# Altium project LimeSDR_Mini_2v0.PrjPcb (part 4 of 4)

## Sheet 10_Misc.SchDoc: Misc
size A3; Organization: Lime Microsystems; Address1: Surrey Tech Centre; Address2: Guildford GU2 7YG; Address3: Surrey; Address4: United Kingdom; Revision: v2.0; SheetNumber: 10; SheetTotal: 10
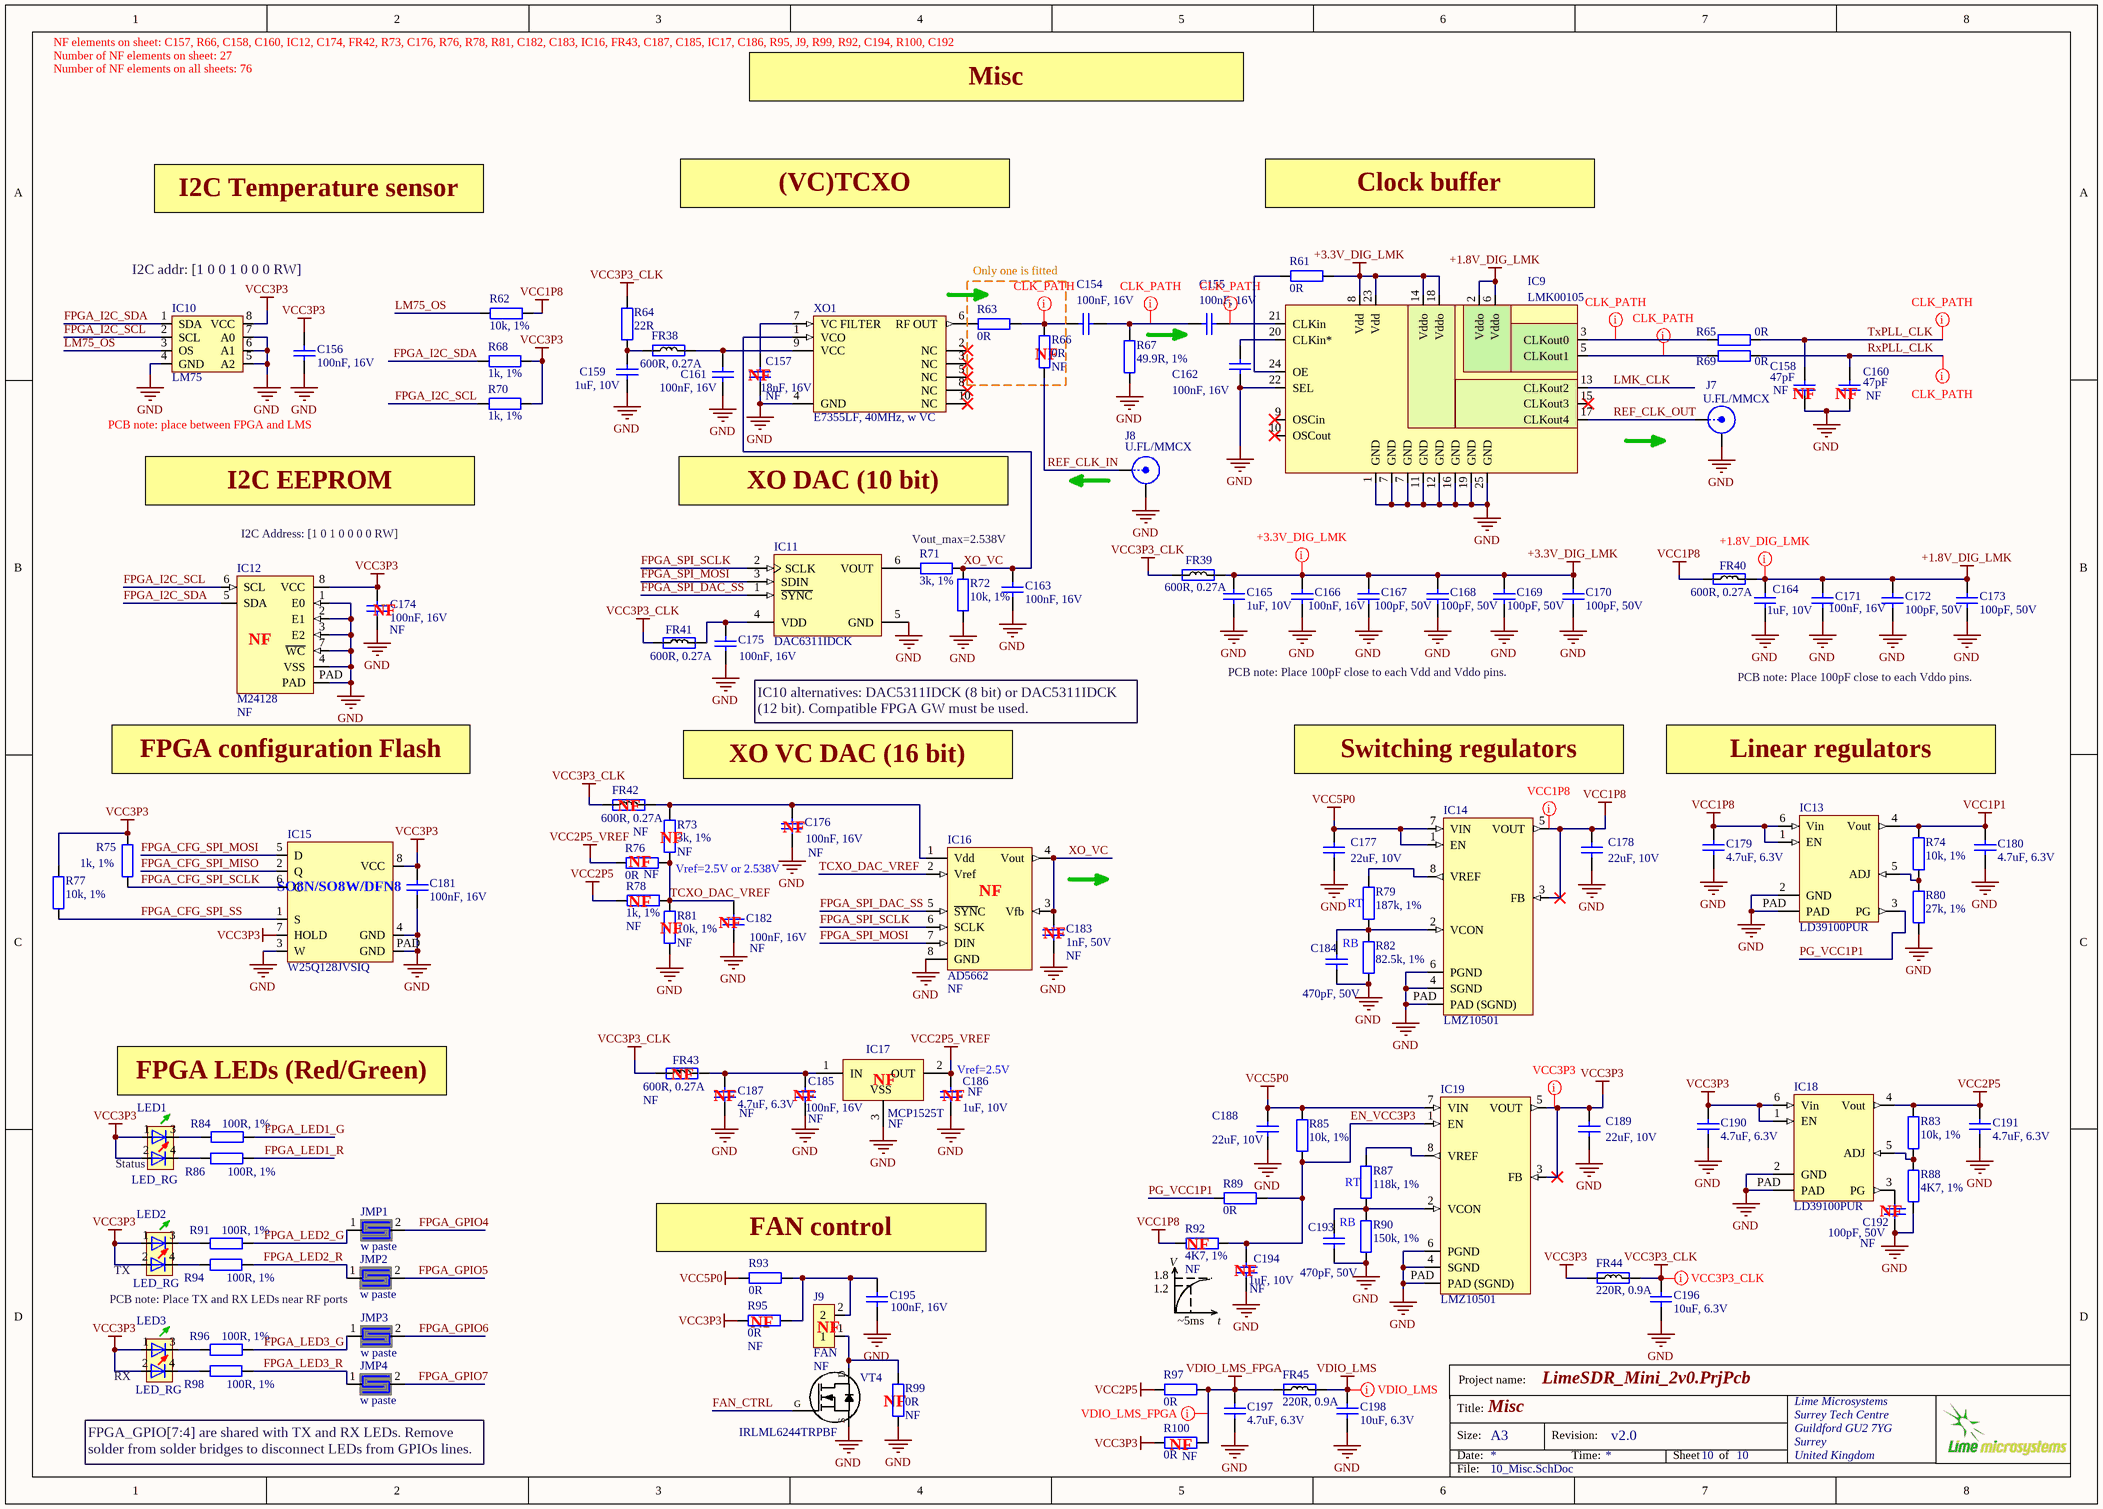
[diagram p9: 10_Misc.SchDoc]

### Parts
C154  100nF, 16V  [CAP0402]
C155  100nF, 16V  [CAP0402]
C156  100nF, 16V  [CAP0402]
C157  18nF, 16V  Assembly Info: NF  [CAP0402]
C158  47pF  Assembly Info: NF  [CAP0402]
C159  1uF, 10V  [CAP0402]
C160  47pF  Assembly Info: NF  [CAP0402]
C161  100nF, 16V  [CAP0402]
C162  100nF, 16V  [CAP0402]
C163  100nF, 16V  [CAP0402]
C164  1uF, 10V  [CAP0402]
C165  1uF, 10V  [CAP0402]
C166  100nF, 16V  [CAP0402]
C167  100pF, 50V  [CAP0402]
C168  100pF, 50V  [CAP0402]
C169  100pF, 50V  [CAP0402]
C170  100pF, 50V  [CAP0402]
C171  100nF, 16V  [CAP0402]
C172  100pF, 50V  [CAP0402]
C173  100pF, 50V  [CAP0402]
C174  100nF, 16V  Assembly Info: NF  [CAP0402]
C175  100nF, 16V  [CAP0402]
C176  100nF, 16V  Assembly Info: NF  [CAP0402]
C177  22uF, 10V  [CAP0603]
C178  22uF, 10V  [CAP0603]
C179  4.7uF, 6.3V  [CAP0402]
C180  4.7uF, 6.3V  [CAP0402]
C181  100nF, 16V  [CAP0402]
C182  100nF, 16V  Assembly Info: NF  [CAP0402]
C183  1nF, 50V  Assembly Info: NF  [CAP0402]
C184  470pF, 50V  [CAP0402]
C185  100nF, 16V  Assembly Info: NF  [CAP0402]
C186  1uF, 10V  Assembly Info: NF  [CAP0402]
C187  4.7uF, 6.3V  Assembly Info: NF  [CAP0402]
C188  22uF, 10V  [CAP0603]
C189  22uF, 10V  [CAP0603]
C190  4.7uF, 6.3V  [CAP0402]
C191  4.7uF, 6.3V  [CAP0402]
C192  100pF, 50V  Assembly Info: NF  [CAP0402]
C193  470pF, 50V  [CAP0402]
C194  1uF, 10V  Assembly Info: NF  [CAP0402]
C195  100nF, 16V  [CAP0402]
C196  10uF, 6.3V  [CAP0603]
C197  4.7uF, 6.3V  [CAP0402]
C198  10uF, 6.3V  [CAP0603]
FR38  600R, 0.27A  [RES0201]
FR39  600R, 0.27A  [RES0201]
FR40  600R, 0.27A  [RES0201]
FR41  600R, 0.27A  [RES0201]
FR42  600R, 0.27A  Assembly Info: NF  [RES0201]
FR43  600R, 0.27A  Assembly Info: NF  [RES0201]
FR44  220R, 0.9A  [RES0402]
FR45  220R, 0.9A  [RES0402]
IC9  LMK00105  [LMK00105SQ]
IC10  LM75  [HWSON8_LM75]
IC11  DAC6311IDCK  [AD5601_SOT23-6]
IC12  M24128  Assembly Info: NF  [M24128-DFMC6TG]
IC13  LD39100PUR  [LD39100PUR]
IC14  LMZ10501  [LMZ10501]
IC15  W25Q128JVSIQ  [S25FL164K_WSON8_DFN6]
IC16  AD5662  Assembly Info: NF  [AD5662_SOT23-8]
IC17  MCP1525T  Assembly Info: NF  [SOT23-3_v2]
IC18  LD39100PUR  [LD39100PUR]
IC19  LMZ10501  [LMZ10501]
J7  U.FL/MMCX  [MMCX_UFL_conn_u]
J8  U.FL/MMCX  [MMCX_UFL_conn_u]
J9  FAN  Assembly Info: NF  [Header2x1_TH_v2]
JMP1  w paste  [JUMPER_0P15_W_PASTE]  (no BOM)
JMP2  w paste  [JUMPER_0P15_W_PASTE]  (no BOM)
JMP3  w paste  [JUMPER_0P15_W_PASTE]  (no BOM)
JMP4  w paste  [JUMPER_0P15_W_PASTE]  (no BOM)
LED1  LED_RG  [LED-2x0603]
LED2  LED_RG  [LED-2x0603]
LED3  LED_RG  [LED-2x0603]
R61  0R  [RES0402]
R62  10k, 1%  [RES0402]
R63  0R  [RES0402]
R64  22R  [RES0402]
R65  0R  [RES0402]
R66  0R  Assembly Info: NF  [RES0402]
R67  49.9R, 1%  [RES0402]
R68  1k, 1%  [RES0402]
R69  0R  [RES0402]
R70  1k, 1%  [RES0402]
R71  3k, 1%  [RES0402]
R72  10k, 1%  [RES0402]
R73  3k, 1%  Assembly Info: NF  [RES0402]
R74  10k, 1%  [RES0402]
R75  1k, 1%  [RES0402]
R76  0R  Assembly Info: NF  [RES0402]
R77  10k, 1%  [RES0402]
R78  1k, 1%  Assembly Info: NF  [RES0402]
R79  187k, 1%  [RES0402]
R80  27k, 1%  [RES0402]
R81  10k, 1%  Assembly Info: NF  [RES0402]
R82  82.5k, 1%  [RES0402]
R83  10k, 1%  [RES0402]
R84  100R, 1%  [RES0402]
R85  10k, 1%  [RES0402]
R86  100R, 1%  [RES0402]
R87  118k, 1%  [RES0402]
R88  4K7, 1%  [RES0402]
R89  0R  [RES0402]
R90  150k, 1%  [RES0402]
R91  100R, 1%  [RES0402]
R92  4K7, 1%  Assembly Info: NF  [RES0402]
R93  0R  [RES0402]
R94  100R, 1%  [RES0402]
R95  0R  Assembly Info: NF  [RES0402]
R96  100R, 1%  [RES0402]
R97  0R  [RES0402]
R98  100R, 1%  [RES0402]
R99  0R  Assembly Info: NF  [RES0402]
R100  0R  Assembly Info: NF  [RES0402]
VT4  IRLML6244TRPBF  [SOT23-3]
XO1  E7355LF, 40MHz, w VC  [RAKON_RTX5032A]

### Blocks framed on the sheet
Only one is fitted: R63 R66

### Nets
+1.8V_DIG_LMK: C164.2 C171.2 C172.2 C173.2 FR40.2 IC9.2(Vddo) IC9.6(Vddo)
+3.3V_DIG_LMK: C165.2 C166.2 C167.2 C168.2 C169.2 C170.2 FR39.2 IC9.8(Vdd) IC9.14(Vddo) IC9.18(Vddo) IC9.23(Vdd) R61.2
GND: C156.2 C157.1 C158.1 C159.1 C160.1 C161.1 C162.1 C163.1 C164.1 C165.1 C166.1 C167.1 C168.1 C169.1 C170.1 C171.1 C172.1 C173.1 C174.2 C175.2 C176.2 C177.1 C178.1 C179.1 C180.1 C181.2 C182.2 C183.2 C184.2 C185.2 C186.1 C187.1 C188.1 C189.1 C190.1 C191.1 C192.1 C193.2 C194.1 C195.2 C196.1 C197.1 C198.1 IC9.1(GND) IC9.7(GND) IC9.11(GND) IC9.12(GND) IC9.16(GND) IC9.19(GND) IC9.22(SEL) IC9.25(GND) IC10.4(GND) IC10.5(A2) IC10.6(A1) IC10.7(A0) IC11.5(GND) IC12.1(E0) IC12.2(E1) IC12.3(E2) IC12.4(VSS) IC12.7(~{WC}) IC12.PAD IC13.2(GND) IC13.PAD IC14.4(SGND) IC14.6(PGND) IC14.PAD(PAD_(SGND)) IC15.3(W) IC15.4(GND) IC15.PAD(GND) IC16.8(GND) IC17.3(VSS) IC18.2(GND) IC18.PAD IC19.4(SGND) IC19.6(PGND) IC19.PAD(PAD_(SGND)) J7.2(Y) J8.2(Y) R67.1 R72.2 R80.2 R81.2 R82.1 R88.2 R90.1 R99.1 VT4.S XO1.4(GND)
VCC1P1: C180.2 IC13.4(Vout) R74.2
VCC1P8: C178.2 C179.2 FR40.1 IC13.1(EN) IC13.6(Vin) IC14.3(FB) IC14.5(VOUT) R62.2 R92.2
VCC2P5: C191.2 IC18.4(Vout) R78.2 R83.2 R97.1
VCC2P5_VREF: C186.2 IC17.2(OUT) R76.1
VCC3P3: C156.1 C174.1 C181.1 C189.2 C190.2 FR44.1 IC10.8(VCC) IC12.8(VCC) IC15.7(HOLD) IC15.8(VCC) IC18.1(EN) IC18.6(Vin) IC19.3(FB) IC19.5(VOUT) LED1.1 LED1.2 LED2.1 LED2.2 LED3.1 LED3.2 R68.1 R70.1 R75.2 R77.2 R95.1 R100.1
VCC3P3_CLK: C196.2 FR39.1 FR41.1 FR42.1 FR43.1 FR44.2 R64.2
VCC5P0: C177.2 C188.2 IC14.1(EN) IC14.7(VIN) IC19.7(VIN) R85.2 R93.1
VDIO_LMS: C198.2 FR45.2
VDIO_LMS_FPGA: C197.2 FR45.1 R97.2 R100.2
EN_VCC3P3: C194.2 IC19.1(EN) R85.1 R89.2 R92.1
FAN_CTRL: VT4.G
FPGA_CFG_SPI_MISO: IC15.2(Q)
FPGA_CFG_SPI_MOSI: IC15.5(D)
FPGA_CFG_SPI_SCLK: IC15.6(C) R75.1
FPGA_CFG_SPI_SS: IC15.1(S) R77.1
FPGA_GPIO4: JMP1.2
FPGA_GPIO5: JMP2.2
FPGA_GPIO6: JMP3.2
FPGA_GPIO7: JMP4.2
FPGA_I2C_SCL: IC10.2(SCL) IC12.6(SCL) R70.2
FPGA_I2C_SDA: IC10.1(SDA) IC12.5(SDA) R68.2
FPGA_LED1_G: R84.2
FPGA_LED1_R: R86.2
FPGA_LED2_G: JMP1.1 R91.2
FPGA_LED2_R: JMP2.1 R94.2
FPGA_LED3_G: JMP3.1 R96.2
FPGA_LED3_R: JMP4.1 R98.2
FPGA_SPI_DAC_SS: IC11.1(~{SYNC}) IC16.5(~{SYN}C)
FPGA_SPI_MOSI: IC11.3(SDIN) IC16.7(DIN)
FPGA_SPI_SCLK: IC11.2(SCLK) IC16.6(SCLK)
LM75_OS: IC10.3(OS) R62.1
LMK_CLK: IC9.13(CLKout2)
PG_VCC1P1: IC13.3(PG) R89.1
REF_CLK_IN: J8.1(X) R66.1
REF_CLK_OUT: IC9.17(CLKout4) J7.1(X)
RxPLL_CLK: C160.2 R69.1
TCXO_DAC_VREF: C182.1 IC16.2(Vref) R73.1 R76.2 R78.1 R81.1
TxPLL_CLK: C158.2 R65.1
XO_VC: C163.2 C183.1 IC16.3(Vfb) IC16.4(Vout) R71.1 R72.1 XO1.1(VCO)
NetC154_1: C154.1 C155.2 R67.2
NetC154_2: C154.2 R63.2 R66.2
NetC155_1: C155.1 IC9.21(CLKin)
NetC157_2: C157.2 XO1.7(VC_FILTER)
NetC159_2: C159.2 FR38.1 R64.1
NetC161_2: C161.2 FR38.2 XO1.9(VCC)
NetC162_2: C162.2 IC9.20(CLKin*)
NetC175_1: C175.1 FR41.2 IC11.4(VDD)
NetC176_1: C176.1 FR42.2 IC16.1(Vdd) R73.2
NetC184_1: C184.1 IC14.2(VCON) R79.1 R82.2
NetC185_1: C185.1 C187.2 FR43.2 IC17.1(IN)
NetC192_2: C192.2 IC18.3(PG)
NetC193_1: C193.1 IC19.2(VCON) R87.1 R90.2
NetC195_1: C195.1 J9.2 R93.2 R95.2
NetIC9_3: IC9.3(CLKout0) R65.2
NetIC9_5: IC9.5(CLKout1) R69.2
NetIC9_24: IC9.24(OE) R61.1
NetIC11_6: IC11.6(VOUT) R71.2
NetIC13_5: IC13.5(ADJ) R74.1 R80.1
NetIC14_8: IC14.8(VREF) R79.2
NetIC18_5: IC18.5(ADJ) R83.1 R88.1
NetIC19_8: IC19.8(VREF) R87.2
NetJ9_1: J9.1 R99.2 VT4.D
NetLED1_3: LED1.3 R84.1
NetLED1_4: LED1.4 R86.1
NetLED2_3: LED2.3 R91.1
NetLED2_4: LED2.4 R94.1
NetLED3_3: LED3.3 R96.1
NetLED3_4: LED3.4 R98.1
NetR63_1: R63.1 XO1.6(RF_OUT)

Not connected (* = marked no-connect by the designer): IC9 9(OSCin)* 10(OSCout)* 15(CLKout3)*; XO1 2(NC)* 3(NC)* 5(NC)* 8(NC)* 10(NC)*

### Layout directives
net class CLK_PATH: NetC154_1, NetC154_2, NetC155_1, NetIC9_3, NetIC9_5, RxPLL_CLK, TxPLL_CLK
net class VCC3P3: VCC3P3
net class +3.3V_DIG_LMK: +3.3V_DIG_LMK
net class +1.8V_DIG_LMK: +1.8V_DIG_LMK
net class VCC3P3_CLK: VCC3P3_CLK
net class VCC1P8: VCC1P8
net class VDIO_LMS: VDIO_LMS
net class VDIO_LMS_FPGA: VDIO_LMS_FPGA

### Notes on the sheet
- NF elements on sheet: C157, R66, C158, C160, IC12, C174, FR42, R73, C176, R76, R78, R81, C182, C183, IC16, FR43, C187, C185, IC17, C186, R95, J9, R99, R92, C194, R100, C192
- Number of NF elements on sheet: 27
- Number of NF elements on all sheets: 76
- Misc
- I2C Temperature sensor
- (VC)TCXO
- Clock buffer
- I2C addr: [1 0 0 1 0 0 0 RW]
- (near C157) NF
- (near R66) NF
- PCB note: place between FPGA and LMS
- (near C158) NF
- (near C160) NF
- I2C EEPROM
- XO DAC (10 bit)
- I2C Address: [1 0 1 0 0 0 0 RW]
- Vout_max=2.538V
- (near IC12) NF
- (near C174) NF
- IC10 alternatives: DAC5311IDCK (8 bit) or DAC5311IDCK (12 bit). Compatible FPGA GW must be used.
- PCB note: Place 100pF close to each Vdd and Vddo pins.
- PCB note: Place 100pF close to each Vddo pins.
- (near IC12) FPGA configuration Flash
- XO VC DAC (16 bit)
- Switching regulators
- Linear regulators
- (near FR42) NF
- (near R73) NF
- (near C176) NF
- (near R78) NF
- (near R76) NF
- Vref=2.5V or 2.538V
- (near IC16) NF
- (near R79) RT
- (near R81) NF
- (near C182) NF
- NF
- (near C184) RB
- FPGA LEDs (Red/Green)
- (near FR43) NF
- (near C187) NF
- (near C185) NF
- (near IC17) NF
- (near C186) NF
- (near C186) Vref=2.5V
- (near LED1) Status
- (near R87) RT
- FAN control
- (near R92) NF
- (near C193) RB
- (near JMP2) PCB note: Place TX and RX LEDs near RF ports
- (near LED2) TX
- (near R95) NF
- (near R92) 1.8
- (near R92) 1.2
- (near R92) V
- ~5ms
- t
- (near C194) NF
- (near LED3) RX
- (near J9) NF
- FPGA_GPIO[7:4] are shared with TX and RX LEDs. Remove solder from solder bridges to disconnect LEDs from GPIOs lines.
- (near R99) NF
- (near R100) NF
- Project name:
- Title:
- Size:
- Date:
- A3
- Revision:
- Time:
- Sheet
- of
- File:
- (in symbol M25P40_with_pad) SO8N/SO8W/DFN8

### Library data of the parts
C154 C155 C161-C163 C166 C171 = Cap_0402: as C97 on sheet 08_FPGA; Value: 100nF, 16V; Supplier 1: Mouser; Supplier Part Number 1: 81-GRM155R71C104KA88; Case Code - in: 0402; RoHS: RoHS Compliant; Operating Temperature Range: - 55 C to + 125 C; Series: GRM; Termination Style: SMD/SMT; Package / Case: 0402 (1005 metric); Voltage Rating DC: 16 V; Maximum Operating Temperature: + 125 C; Case Code - mm: 1005; Minimum Operating Temperature: - 55 C; Product Category: Low & Medium Capacitance SMD Ceramic Chip Capacitors; Packaging: Reel; Product: General Type MLCCs; Category: Multilayer Ceramic Capacitors MLCC - SMD/SMT; Brand: Murata Electronics; Case Width: 0.5 mm; RoHS - Mouser: Y; Standard Pack Qty: 10000; Minimum Order Quantity: 1; Reeling: True; Manufacturer Part Number 1: GRM155R71C104KA88D
C156 C174-C176 C181 C182 C185 C195 = Cap_0603: as C129 on sheet 09_USB3_0_FIFO; Supplier 1: Mouser; Supplier Part Number 1: 81-GRM155R71C104KA88; Case Code - in: 0402; Manufacturer: Murata Electronics; Category: Multilayer Ceramic Capacitors MLCC - SMD/SMT; Voltage Rating DC: 16 V; Value: 100nF, 16V; Case Code - mm: 1005; Case Width: 0.5 mm; Maximum Operating Temperature: + 125 C; Minimum Operating Temperature: - 55 C; Minimum Order Quantity: 1; Operating Temperature Range: - 55 C to + 125 C; Package / Case: 0402 (1005 metric); Packaging: Reel; Product: General Type MLCCs; Product Category: Low & Medium Capacitance SMD Ceramic Chip Capacitors; Reeling: True; RoHS - Mouser: Y; RoHS: RoHS Compliant; Series: GRM; Standard Pack Qty: 10000; Termination Style: SMD/SMT
  C156 C174-C176 C181 C195: Manufacturer Part Number: GRM155R71C104KA88D
C157 = Cap_0402: Manufacturer: Yageo; Manufacturer Part Number 1: CC0402KRX7R7BB183; Part Description: CAP CER 0.018UF 16V X7R 0402; Temperature Coefficient: X7R; Capacitance: 0.018µF; Tolerance: ±10%; Value: 18nF, 16V; Supplier 1: Digi-Key; Supplier Part Number 1: 311-1706-1-ND; Part Status: Active; Category: Capacitors; Packaging: Cut Tape (CT); Voltage - Rated: 16V; RoHS: RoHS Compliant; Size / Dimension: 0.039" L x 0.020" W (1.00mm x 0.50mm); Package / Case: 0402 (1005 Metric); Mounting Type: Surface Mount, MLCC; Thickness (Max): 0.022" (0.55mm); Applications: General Purpose; Operating Temperature: -55°C ~ 125°C
C158 C160 = Cap_0402: Manufacturer Part Number 1: GRM1555C1H470FA01D; Manufacturer: TDK Corporation; Part Description: 47pF ±1% 50V C0G, NP0 Ceramic Capacitor -55°C ~ 125°C Surface Mount, MLCC 0402 (1005 Metric) 0.039" L x 0.020" W (1.00mm x 0.50mm); Voltage - Rated: 50V; Temperature Coefficient: C0G, NP0; Tolerance: ±1%; Value: 47pF; Supplier 1: Digi-Key; Supplier Part Number 1: 490-6241-1-ND; Package / Case: 0402 (1005 Metric); Lead Spacing: -; Ratings: -; Mounting Type: Surface Mount, MLCC; Operating Temperature: -55°C ~ 125°C; Thickness (Max): 0.022" (0.55mm); Capacitance: 47pF; Packaging: Cut Tape (CT); Features: -; Applications: General Purpose; Lead Style: -; Size / Dimension: 0.039" L x 0.020" W (1.00mm x 0.50mm); Height - Seated (Max): -; RoHS: RoHS Compliant; Category: Capacitors
C159 C164 C165 C186 C194 = Cap_0402: Manufacturer Part Number 1: C1005X5R1E105K050BC; Manufacturer: TDK; Part Description: 1µF ±10% 10V X5R Ceramic Capacitor -55°C ~ 85°C Surface Mount, MLCC 0402 (1005 Metric) 0.039" L x 0.020" W (1.00mm x 0.50mm); Voltage Rating: 10; Capacitance Tolerance: ± 10%; Product Range: TDK - C Series; Ceramic Capacitor Case: 0402 [1005 Metric]; Capacitance: 1; Dielectric Characteristic: X6; Value: 1uF, 10V; Supplier 1: Digi-Key; Supplier Part Number 1: 445-9066-1-ND; MSL: -; RoHS: YES
C167-C170 C172 C173 C192 = Cap_0402: Manufacturer Part Number 1: CC0402JRNPO9BN101; Manufacturer: Yageo; Part Description: 100pF ±5% 50V C0G, NP0 Ceramic Capacitor -55°C ~ 125°C Surface Mount, MLCC 0402 (1005 Metric) 0.039" L x 0.020" W (1.00mm x 0.50mm); Temperature Coefficient: C0G, NP0; Tolerance: ±5%; Value: 100pF, 50V; Supplier 1: Digi-Key; Supplier Part Number 1: 311-1024-1-ND; RoHS: RoHS Compliant; Category: Capacitors; Applications: General Purpose; Mounting Type: Surface Mount, MLCC; Capacitance: 100pF; Ratings: -; Packaging: Cut Tape (CT); Voltage - Rated: 50V; Size / Dimension: 0.039" L x 0.020" W (1.00mm x 0.50mm); Height - Seated (Max): -; Package / Case: 0402 (1005 Metric); Operating Temperature: -55°C ~ 125°C; Features: -; Lead Spacing: -; Lead Style: -; Thickness (Max): 0.022" (0.55mm)
C177 C178 C188 C189 = Cap_0603: Manufacturer Part Number 1: C1608X5R1A226M080AC; Manufacturer: TDK Corporation; Part Description: 22µF ±20% 10V X5R Ceramic Capacitor -55°C ~ 85°C Surface Mount, MLCC 0603 (1608 Metric) 0.063" L x 0.031" W (1.60mm x 0.80mm); Brand: TDK; Temperature Coefficient / Code: +/- 15 %; Tolerance: 20 %; Type: Multilayer Ceramic Chip Capacitor; Supplier 1: Mouser; Supplier Part Number 1: 810-C1608X5R1A226M; Package / Case: 0603 (1608 metric); Category: Multilayer Ceramic Capacitors MLCC - SMD/SMT; Capacitance: 22 uF; Operating Temperature Range: - 55 C to + 85 C; Case Code - in: 0603; Voltage Rating DC: 10 V; Case Code - mm: 1608; Value: 22uF, 10V
C179 C180 C187 C190 C191 C197 = Cap_0402: Manufacturer: Murata Electronics North America; Manufacturer Part Number 1: GRM155R60J475ME87D; Part Description: 4.7µF ±20% 6.3V X5R Ceramic Capacitor -55°C ~ 85°C Surface Mount, MLCC 0402 (1005 Metric) 0.039" L x 0.020" W (1.00mm x 0.50mm); Tolerance: ±20%; Capacitance: 4.7µF; Temperature Coefficient: X5R; Lead Style: -; Ratings: -; Height - Seated (Max): -; Thickness (Max): 0.022" (0.55mm); Voltage - Rated: 6.3V; Packaging: Cut Tape (CT); Lead Spacing: -; Category: Capacitors; Supplier Part Number 1: 490-5408-1-ND; Applications: General Purpose; Operating Temperature: -55°C ~ 85°C; Mounting Type: Surface Mount, MLCC; Features: Derating Recommended; RoHS: RoHS Compliant; Supplier 1: Digi-Key; Package / Case: 0402 (1005 Metric); Size / Dimension: 0.039" L x 0.020" W (1.00mm x 0.50mm); Value: 4.7uF, 6.3V
C183 = Cap_0402: Manufacturer Part Number 1: GCM155R71H102KA37D; Part Description: 1000pF ±10% 50V X7R Ceramic Capacitor -55°C ~ 125°C Surface Mount, MLCC 0402 (1005 Metric) 0.039" L x 0.020" W (1.00mm x 0.50mm); Capacitance: 1000 pF; Type: Automotive Ultra Small MLCC; Tolerance: 10 %; Brand: Murata Electronics; Case Height: 0.5 mm; Case Length: 1 mm; Dielectric: X7R; Temperature Coefficient / Code: +/- 15 %; Value: 1nF, 50V; Supplier 1: Mouser; Supplier Part Number 1: 81-GCM155R71H102KA7D; Case Code - in: 0402; Package / Case: 0402 (1005 metric); Termination Style: SMD/SMT; Packaging: Reel; Operating Temperature Range: - 55 C to + 125 C; Maximum Operating Temperature: + 125 C; Manufacturer: Murata Electronics; Category: Multilayer Ceramic Capacitors MLCC - SMD/SMT; RoHS: RoHS Compliant; Series: GCM; Case Width: 0.5 mm; Voltage Rating DC: 50 V; Case Code - mm: 1005; Product: Automotive MLCCs; Standard Pack Qty: 10000; Reeling: True; RoHS - Mouser: Y; Minimum Order Quantity: 1; Product Category: Automotive Ceramic Chip Capacitors; Minimum Operating Temperature: - 55 C
C184 C193 = Cap_0402: Manufacturer Part Number 1: C1005C0G1H471J050BA; Manufacturer: TDK Corporation; Part Description: 470pF ±5% 50V Ceramic Capacitor C0G, NP0 0402 (1005 Metric); Tolerance: ±5%; Temperature Coefficient: C0G, NP0; Value: 470pF, 50V; Supplier 1: Digi-Key; Supplier Part Number 1: 445-2656-6-ND; Ratings: -; Package / Case: 0402 (1005 Metric); Capacitance: 470pF; Packaging: Digi-Reel®; RoHS: RoHS Compliant; Lead Style: -; Thickness (Max): 0.022" (0.55mm); Size / Dimension: 0.039" L x 0.020" W (1.00mm x 0.50mm); Lead Spacing: -; Operating Temperature: -55°C ~ 125°C; Height - Seated (Max): -; Applications: General Purpose; Mounting Type: Surface Mount, MLCC; Voltage - Rated: 50V; Category: Capacitors; Features: -
C196 C198 = Cap_0603: as C99 on sheet 08_FPGA; Supplier 1: Digi-Key; Supplier Part Number 1: 311-1448-2-ND; Package / Case: 0603 (1608 Metric); Category: Capacitors; Voltage - Rated: 6.3V; Value: 10uF, 6.3V
FR38-FR43 = Ferrite: Manufacturer Part Number 1: BK0603TS601-T; Manufacturer: Taiyo Yuden; Part Description: FERRITE BEAD 600 OHM 0201 1LN; DC Resistance (DCR): 750 mOhm Max; Filter Type: Differential Mode - Single; Impedance @ Frequency: 600 Ohm @ 100MHz; Current Rating: 270mA; Value: 600R@100MHz; Supplier 1: Digi-Key; Supplier Part Number 1: 587-3277-1-ND; Size / Dimension: 0.024" L x 0.012" W (0.60mm x 0.30mm); Package / Case: 0201 (0603 Metric); Height (Max): 0.013" (0.33mm); Mounting Type: Surface Mount; Packaging: Cut Tape (CT); RoHS: RoHS Compliant; Category: Filters
FR44 FR45 = Ferrite: as FR35 on sheet 09_USB3_0_FIFO; Supplier 1: Digi-Key; Package / Case: 0402 (1005 Metric); Category: Filters; Supplier Part Number 1: 445-9329-2-ND; Value: 220R, 0.9A
IC9 = LMK00105: Manufacturer: Texas Instruments; Manufacturer Part Number 1: LMK00105SQ/NOPB; Part Description: IC CLK BUFFER 2:5 200MHZ 24WQFN; Frequency - Max: 200MHz; Voltage - Supply: 2.375 V ~ 3.45 V; Input: HCSL, LVCMOS, LVDS, LVPECL, LVTTL, SSTL, Crystal; Differential - Input:Output: Yes/No; Supplier 1: Digi-Key; Type: Fanout Buffer (Distribution), Multiplexer, Translator; Category: Integrated Circuits (ICs); Operating Temperature: -40°C ~ 85°C; Package / Case: 24-WFQFN Exposed Pad; Supplier Device Package: 24-WQFN (4x4); Supplier Part Number 1: LMK00105SQ/NOPBCT-ND
IC10 = LM75: Manufacturer: NXP Semiconductors; Manufacturer Part Number 1: LM75BTP,147; Part Description: SENSOR TEMPERATURE I2C 8HWSON; Sensing Temperature - Local: -55°C ~ 125°C; Output Type: I²C; Accuracy - Highest (Lowest): ±2°C (±3°C); Voltage - Supply: 2.8 V ~ 5.5 V; Test Condition: -25°C ~ 100°C (-55°C ~ 125°C); Sensor Type: Digital, Local; Resolution: 10 b; Supplier 1: Digi-Key; Operating Temperature: -55°C ~ 125°C; Features: Output Switch, Programmable Limit, Shutdown Mode; Supplier Device Package: 8-HWSON (2x3); Sensing Temperature - Remote: -; Category: Sensors, Transducers; Packaging: Tape & Reel (TR); RoHS: RoHS Compliant; Package / Case: 8-WFDFN Exposed Pad; Supplier Part Number 1: 568-9815-2-ND
IC11 = AD5601BKSZ-REEL7: Single 8-Bit nanoDAC with SPI Interface in LFCSP and SC70, 2.7 to 5.5 V, <100 uA, -40 to +125 degC, KS-6, Pb-Free, Reel; Manufacturer: Texas Instruments; Manufacturer Part Number 1: DAC6311IDCKT; Part Description: 10 Bit Digital to Analog Converter 1 SC-70-6; Max Power Dissipation: 880uW; Max Supply Voltage: 5.5V; Min Supply Voltage: 1.8V; Number of Channels: 1; Operating Supply Voltage: 5V; Settling Time: 6us; Number of Bits: 10; Resolution: 10b; Sampling Rate: 225KS/s; Polarity: Unipolar; Integral Nonlinearity (INL): 0.5LSB; Spurious-free dynamic range (SFDR): 65dB; Signal to Noise Ratio (SNR): 81dB; Nominal Supply Current: 110uA; Output Type: Voltage; ComponentLink1URL: http://www.ti.com/lit/ds/symlink/dac5311.pdf; ComponentLink1Description: http://www.ti.com/lit/ds/symlink/dac5311.pdf; Supplier 1: Digi-Key; Supplier Part Number 1: 296-23716-1-ND; Stock 1: 13410; Pricing 1: 1=2,37000, 10=2,13100, 25=2,01000, 100=1,71250 (USD); RoHS: Yes; Case/Package: SC; Number of Pins: 6; Contact Plating: Gold; Min Operating Temperature: -40°C; Max Operating Temperature: 125°C; Package Quantity: 1; Packaging: Tape and Reel; Number of DAC Channels: 1; Interface: SPI; Number of Converters: 1; Number of D/A Converters: 1; Termination: SMD/SMT; Supply Type: Single; Conversion Rate: 225KS/s; Differential Nonlinearity: 0.5LSB; Length: 2mm; Width: 1.25mm; Height: 0.9mm; Radiation Hardening: No; REACH SVHC: No SVHC; Lead Free: Lead Free; RoHS Compliant: Yes; ComponentLink2URL: https://datasheet.ciiva.com/1362/dac7311-1362880.pdf?src-supplier=Digi-Key; ComponentLink2Description: https://datasheet.ciiva.com/1362/dac7311-1362880.pdf?src-supplier=Digi-Key; ComponentLink3URL: https://datasheet.ciiva.com/4779/sbas442a-125649-4779152.pdf?src-supplier=Mouser; ComponentLink3Description: https://datasheet.ciiva.com/4779/sbas442a-125649-4779152.pdf?src-supplier=Mouser; ComponentLink4URL: https://datasheet.ciiva.com/1494/1833965-1494412.pdf?src-supplier=Element14; ComponentLink4Description: https://datasheet.ciiva.com/1494/1833965-1494412.pdf?src-supplier=Element14; ComponentLink5URL: https://datasheet.ciiva.com/1503/dac5311-1503186.pdf?src-supplier=Farnell; ComponentLink5Description: https://datasheet.ciiva.com/1503/dac5311-1503186.pdf?src-supplier=Farnell; ComponentLink6URL: https://datasheet.ciiva.com/46391/1833965-46391478.pdf?src-supplier=Element14; ComponentLink6Description: https://datasheet.ciiva.com/46391/1833965-46391478.pdf?src-supplier=Element14; ComponentLink7URL: https://datasheet.ciiva.com/1368/dac5311-1368577.pdf?src-supplier=Digi-Key; ComponentLink7Description: https://datasheet.ciiva.com/1368/dac5311-1368577.pdf?src-supplier=Digi-Key; ComponentLink8URL: https://datasheet.ciiva.com/1368/dac5311-1368578.pdf?src-supplier=Digi-Key; ComponentLink8Description: https://datasheet.ciiva.com/1368/dac5311-1368578.pdf?src-supplier=Digi-Key; ComponentLink9URL: https://datasheet.ciiva.com/15146/getdatasheetpartid-213912-15146949.pdf?src-supplier=Verical; ComponentLink9Description: https://datasheet.ciiva.com/15146/getdatasheetpartid-213912-15146949.pdf?src-supplier=Verical
IC12 = M24128-DFMC6TG: Manufacturer: STMicroelectronics; Part Description: EEPROM Memory IC 128Kb (16K x 8) I²C 1MHz 450ns 8-UFDFPN (2x3); Memory Type: Non-Volatile; Memory Format: EEPROM; Memory Size: 128Kb (16K x 8); Write Cycle Time - Word, Page: 5ms; Memory Interface: I²C; Voltage - Supply: 1.7 V ~ 5.5 V; Supplier 1: Digi-Key; Manufacturer Part Number 1: M24128-DFMC6TG; RoHS: RoHS Compliant; Category: Integrated Circuits (ICs); Stock 1: 5894; Pricing 1: 1=0.35, 10=0.348, 100=0.2854, 500=0.27748, 1000=0.27004 (USD); Packaging: Cut Tape (CT); Part Status: Active; Technology: EEPROM; Operating Temperature: -40°C ~ 85°C (TA); Mounting Type: Surface Mount; Package / Case: 8-UFDFN Exposed Pad; Supplier Device Package: 8-UFDFPN (2x3); ComponentLink1URL: http://www.st.com/content/ccc/resource/technical/document/datasheet/59/05/c9/5b/7b/41/48/b6/CD00259167.pdf/files/CD00259167.pdf/jcr:content/translations/en.CD00259167.pdf; ComponentLink1Description: http://www.st.com/content/ccc/resource/technical/document/datasheet/59/05/c9/5b/7b/41/48/b6/CD00259167.pdf/files/CD00259167.pdf/jcr:content/translations/en.CD00259167.pdf; Supplier Part Number 1: 497-15739-1-ND
IC13 IC18 = LD39100PUR: Manufacturer: STMicroelectronics; Part Description: Linear Voltage Regulator IC Positive Adjustable Output 0.8 V ~ 4.5 V 1A 6-DFN (3x3); Output Configuration: Positive; Output Type: Adjustable; Voltage - Input (Max): 5.5V; Voltage - Output (Min/Fixed): 0.8V; Voltage - Output (Max): 4.6V; Voltage Dropout (Max): 0.4V @ 1A; Current - Output: 1A; Current - Supply: 50µA ~ 300µA; PSRR: 70dB ~ 65dB (1kHz ~ 10kHz); Control Features: Enable, Power Good; Protection Features: Over Current, Over Temperature, Short Circuit; Supplier 1: Digi-Key; Manufacturer Part Number 1: LD39100PUR; RoHS: RoHS Compliant; Category: Integrated Circuits (ICs); Stock 1: 27970; Pricing 1: 1=0.85, 10=0.76, 100=0.5923, 500=0.48926, 1000=0.38625 (USD); Packaging: Cut Tape (CT); Part Status: Active; Operating Temperature: -40°C ~ 125°C; Mounting Type: Surface Mount; Package / Case: 6-VDFN Exposed Pad; Supplier Device Package: 6-DFN (3x3); ComponentLink1URL: http://www.st.com/content/ccc/resource/technical/document/datasheet/72/02/e5/ee/df/36/40/5e/CD00233788.pdf/files/CD00233788.pdf/jcr:content/translations/en.CD00233788.pdf; ComponentLink1Description: http://www.st.com/content/ccc/resource/technical/document/datasheet/72/02/e5/ee/df/36/40/5e/CD00233788.pdf/files/CD00233788.pdf/jcr:content/translations/en.CD00233788.pdf; Supplier Part Number 1: 497-11013-1-ND
IC14 IC19 = LMZ10501: Manufacturer: Texas Instruments; Manufacturer Part Number 1: LMZ10501SILR; Part Description: n  Non-Isolated PoL Module DC DC Converter 1 Output 0.6 ~ 3.6 V 1A 2.7V - 5.5V Input; Voltage - Input (Min): 2.7V; Voltage - Input (Max): 5.5V; Voltage - Output 1: 0.6 ~ 3.6 V; Current - Output (Max): 1A; Efficiency: 95%; Supplier 1: Digi-Key; RoHS: RoHS Compliant; Category: Power Supplies - Board Mount; Stock 1: 26559; Pricing 1: 1=2.46, 5=2.424, 10=2.388, 25=2.318, 50=2.2478, 100=2.1776, 250=2.1074, 500=1.96688 (USD); Packaging: Cut Tape (CT); Part Status: Active; Type: Non-Isolated PoL Module; Voltage - Output 2: -; Voltage - Output 3: -; Applications: ITE (Commercial); Features: OCP, OTP, UVLO; Operating Temperature: -40°C ~ 125°C; Mounting Type: Surface Mount; Package / Case: 8-LDFN Exposed Pad, Module; Size / Dimension: 0.12" L x 0.10" W x 0.03" H (3.0mm x 2.5mm x 0.7mm); Supplier Device Package: 8-uSIP; ComponentLink1URL: http://www.ti.com/lit/ds/symlink/lmz10501.pdf; ComponentLink1Description: http://www.ti.com/lit/ds/symlink/lmz10501.pdf; Supplier Part Number 1: 296-37104-1-ND
IC15 = M25P40_with_pad: Manufacturer: Winbond; Part Description: FLASH - NOR Memory IC 128Mb (16M x 8) SPI - Quad I/O, QPI, DTR 133 MHz 8-SOIC; Memory Type: FLASH,NOR; Frequency: 104MHz; Interface: SPI,Serial; Supplier 1: Digi-Key; Supplier Part Number 1: W25Q128JVSIQ-ND; Manufacturer Part Number 1: W25Q128JVSIQ; Stock 1: 7729; Pricing 1: 1=1,88000, 10=1,71400, 25=1,66760, 50=1,65880, 100=1,48280, 250=1,47852, 500=1,45618, 1000=1,39437, 5000=1,29820 (USD); RoHS: Yes; Case/Package: SOIC; Min Operating Temperature: -40°C; Max Operating Temperature: 85°C; Packaging: Tray; RoHS Compliant: Yes; ComponentLink1URL: http://www.winbond.com/resource-files/w25q128jv%20revf%2003272018%20plus.pdf?src-supplier=Digi-Key; ComponentLink1Description: http://www.winbond.com/resource-files/w25q128jv%20revf%2003272018%20plus.pdf?src-supplier=Digi-Key
IC16 = AD5662: Manufacturer: Analog Devices Inc.; Manufacturer Part Number 1: AD5662BRJZ-2REEL7; Part Description: IC DAC 16BIT BUFF V-OUT SOT23-8; Number of Bits: 16; Number of D/A Converters: 1; Settling Time: 10µs; Output Type: Voltage - Buffered; Differential Output: No; Data Interface: SPI, DSP; Reference Type: External; Voltage - Supply, Analog: 2.7 V ~ 5.5 V; INL/DNL (LSB): ±8, ±1 (Max); Architecture: String DAC; Supplier 1: Digi-Key; RoHS: RoHS Compliant; Category: Integrated Circuits (ICs); Stock 1: 2784; Pricing 1: 1=7.55, 10=6.821, 100=5.6469, 500=4.91722, 1000=4.28274 (USD); Packaging: Cut Tape (CT); Part Status: Active; Voltage - Supply, Digital: 2.7 V ~ 5.5 V; Operating Temperature: -40°C ~ 125°C; Package / Case: SOT-23-8; Supplier Device Package: SOT-23-8; ComponentLink1URL: http://www.analog.com/media/en/technical-documentation/data-sheets/AD5662.pdf; ComponentLink1Description: http://www.analog.com/media/en/technical-documentation/data-sheets/AD5662.pdf; Supplier Part Number 1: AD5662BRJZ-2REEL7CT-ND
IC17 = MCP1525T-I/TT: 2.5V Voltage Reference, 3-Pin SOT-23, Industrial Temperature, Tape and Reel; Manufacturer: Microchip Technology; Part Description: Series Voltage Reference IC ±1% 2mA SOT-23-3; Reference Type: Series; Output Type: Fixed; Current - Output: 2mA; Tolerance: ±1%; Temperature Coefficient: 50ppm/°C; Noise - 0.1Hz to 10Hz: 90µVp-p; Noise - 10Hz to 10kHz: 500µVrms; Voltage - Input: 2.7 V ~ 5.5 V; Current - Supply: 120µA; PackageDescription: Series Voltage Reference IC ±1% 2mA SOT-23-3; Supplier 1: Digi-Key; Manufacturer Part Number 1: MCP1525T-I/TT; RoHS: RoHS Compliant; Category: Integrated Circuits (ICs); Stock 1: 16612; Pricing 1: 1=0.77, 25=0.64, 100=0.58 (USD); Packaging: Digi-Reel®; Part Status: Active; Voltage - Output (Min/Fixed): 2.5V; Voltage - Output (Max): -; Current - Cathode: -; Operating Temperature: -40°C ~ 85°C (TA); Mounting Type: Surface Mount; Package / Case: TO-236-3, SC-59, SOT-23-3; Supplier Device Package: SOT-23-3; ComponentLink1URL: http://www.microchip.com/mymicrochip/filehandler.aspx?ddocname=en011331; ComponentLink1Description: http://www.microchip.com/mymicrochip/filehandler.aspx?ddocname=en011331; Supplier Part Number 1: MCP1525T-I/TTDKR-ND
J7 J8 = RF_IF_connector: CONN UMC RCPT STR 50 OHM SMD; Manufacturer: Molex, LLC; Manufacturer Part Number 1: 0734120110; Part Description: Ultra Miniature Coaxial Connector Receptacle, Male Pin 50 Ohm Surface Mount Solder; Body Finish: Nickel; Body Material: Phosphor Bronze; Center Contact Material: Brass; Center Contact Plating: Gold; Connector Style: Ultra Miniature Coaxial; Connector Type: Jack, Male Pin; Contact Termination: Solder; Dielectric Material: Liquid Crystal Polymer (LCP); Frequency - Max: 6GHz; Impedance: 50 Ohm; Voltage Rating: 60V; Cable Group: -; Category: Connectors, Interconnects; Fastening Type: Snap-On; Features: -; Housing Color: Silver; Ingress Protection: -; Mounting Type: Surface Mount; Operating Temperature: -40°C ~ 90°C; Packaging: Cut Tape (CT); RoHS: RoHS Compliant; Shield Termination: Solder; Supplier 1: Digi-Key; Supplier Part Number 1: WM5587CT-ND
J9 = Jumper: Manufacturer Part Number 1: 961102-6404-AR; Part Description: 2 Positions Header, Unshrouded Connector 0.100" (2.54mm) Through Hole Gold; Manufacturer: 3M; Connector Type: Header, Unshrouded; Supplier 1: Digi-Key; Supplier Part Number 1: 3M9447-ND; Contact Type: Male Pin; Color: Black; Mounting Type: Through Hole; Category: Connectors, Interconnects; Contact Finish: Gold
JMP1-JMP4 = JUMPER_W_PASTE
LED1-LED3 = LED_green_red_SMD: Manufacturer Part Number 1: HSMF-C165; Manufacturer: Avago Technologies US Inc.; Part Description: LED GREEN/RED DIFFUSED 0603 SMD; Millicandela Rating: 15mcd Green, 10mcd Red; Lens Transparency: Diffused; Lens Color: White; Lens Style/Size: Rectangle with Flat Top, 1.60mm x 0.80mm; Wavelength - Peak: 570nm Green, 636nm Red; Wavelength - Dominant: 572nm Green, 621nm Red; Viewing Angle: 120°; Voltage - Forward (Vf) (Typ): 2.2V Green, 1.95V Red; Current - Test: 20mA; Color: Green, Red; Supplier 1: Digi-Key; Height (Max): 0.50mm; Packaging: Cut Tape (CT); Category: Optoelectronics; Mounting Type: Surface Mount; Package / Case: 0603 (1608 Metric); Size / Dimension: 1.60mm L x 0.80mm W; Supplier Device Package: *; RoHS: RoHS Compliant; Supplier Part Number 1: 516-1419-1-ND
R61 R63 R66 R76 R89 R93 R95 R99 = Res_0402: as R53 on sheet 09_USB3_0_FIFO; Value: 0R; Supplier 1: Digi-Key; Supplier Part Number 1: 311-0.0JRTR-ND; Category: Resistors; Temperature Coefficient: -; Features: Moisture Resistant; Supplier Device Package: 0402; Height: 0.016" (0.40mm); Package / Case: 0402 (1005 Metric); Operating Temperature: -55°C ~ 155°C; Size / Dimension: 0.039" L x 0.020" W (1.00mm x 0.50mm); Composition: Thick Film; Packaging: Tape & Reel (TR); Number of Terminations: 2; RoHS: RoHS Compliant
R62 R72 R74 R77 R81 R83 R85 = Res_0402: as R54-R56 on sheet 09_USB3_0_FIFO; Value: 10k, 1%; Supplier 1: Digi-Key; Supplier Part Number 1: 311-10.0KLRTR-ND; Resistance (Ohms): 10k; Packaging: Tape & Reel (TR); RoHS: RoHS Compliant; Package / Case: 0402 (1005 Metric); Tolerance: ±1%; Operating Temperature: -55°C ~ 155°C; Size / Dimension: 0.039" L x 0.020" W (1.00mm x 0.50mm); Number of Terminations: 2; Category: Resistors; Height: 0.016" (0.40mm); Supplier Device Package: 0402; Features: Moisture Resistant; Composition: Thick Film
R64 = Res_0402: as R59 on sheet 09_USB3_0_FIFO; Supplier 1: Digi-Key; Supplier Part Number 1: 311-22.0LRTR-ND; Supplier Device Package: 0402; Composition: Thick Film; Category: Resistors; Value: 22R
R65 R69 R97 R100 = Res_0402: as R42-R46 on sheet 08_FPGA; Supplier 1: Digi-Key; Supplier Part Number 1: 311-0.0JRTR-ND; Composition: Thick Film; Package / Case: 0402 (1005 Metric); Category: Resistors; Value: 0R; Features: Moisture Resistant; Height: 0.016" (0.40mm); Number of Terminations: 2; Operating Temperature: -55°C ~ 155°C; Packaging: Tape & Reel (TR); RoHS: RoHS Compliant; Size / Dimension: 0.039" L x 0.020" W (1.00mm x 0.50mm); Supplier Device Package: 0402; Temperature Coefficient: -
R67 = Res_0402: Manufacturer: Samsung Electro-Mechanics America, Inc.; Manufacturer Part Number 1: RC1005F49R9CS; Part Description: RES SMD 49.9 OHM 1% 1/16W 0402; Temperature Coefficient: ±100ppm/°C; Resistance (Ohms): 49.9; Power (Watts): 0.063W, 1/16W; Number of Terminations: 2; Size / Dimension: 0.039" L x 0.020" W (1.00mm x 0.50mm); Supplier Device Package: 0402 (1005 Metric); RoHS: RoHS Compliant; Supplier Part Number 1: 1276-3469-6-ND; Features: -; Packaging: Digi-Reel®; Tolerance: ±1%; Height: 0.016" (0.40mm); Category: Resistors; Composition: Thick Film; Package / Case: 0402 (1005 Metric); Supplier 1: Digi-Key; Operating Temperature: -55°C ~ 155°C; Value: 49.9R, 1%
R68 R70 R75 R78 = Res_0402: Manufacturer: Stackpole Electronics Inc; Manufacturer Part Number 1: RMCF0402FT1K00; Part Description: RES SMD 1K OHM 1% 1/16W 0402; Temperature Coefficient: ±100ppm/°C; Power (Watts): 0.063W, 1/16W; Value: 1k, 1%; Supplier 1: Digi-Key; Supplier Part Number 1: RMCF0402FT1K00TR-ND; Package / Case: 0402 (1005 Metric); Supplier Device Package: 0402; Height: 0.016" (0.40mm); Size / Dimension: 0.039" L x 0.020" W (1.00mm x 0.50mm); Number of Terminations: 2; Category: Resistors; Composition: Thick Film; Resistance (Ohms): 1k; Tolerance: ±1%; Operating Temperature: -55°C ~ 155°C; RoHS: RoHS Compliant
  R68 R70 R75: Packaging: Cut Tape (CT); Features: Moisture Resistant
  R78: Packaging: Tape & Reel (TR); Features: -
R71 R73 = Res_0402: Manufacturer: Vishay Dale; Part Description: RES SMD 3K OHM 1% 1/16W 0402; Manufacturer Part Number 1: RMCF0402FT3K00; Temperature Coefficient: ±100ppm/°C; Power (Watts): 0.063W, 1/16W; Value: 3k, 1%; Category: Resistors; Tolerance: ±1%; RoHS: RoHS Compliant; Composition: Thick Film; Number of Terminations: 2; Operating Temperature: -55°C ~ 155°C; Supplier Device Package: 0402 (1005 Metric); Supplier Part Number 1: RMCF0402FT3K00TR-ND; Packaging: Cut Tape (CT); Supplier 1: Digi-Key; Package / Case: 0402 (1005 Metric); Features: Automotive AEC-Q200; Resistance (Ohms): 3k; Height: 0.016" (0.40mm); Size / Dimension: 0.039" L x 0.020" W (1.00mm x 0.50mm)
R79 = Res_0402: Manufacturer Part Number 1: RC0402FR-07187KL; Manufacturer: Yageo; Part Description: 187 kOhms ±1% 0.063W, 1/16W Chip Resistor 0402 (1005 Metric) Moisture Resistant Thick Film; Power (Watts): 0.063W, 1/16W; Temperature Coefficient: ±100ppm/°C; Value: 187k, 1%; Tolerance: ±1%; Height - Seated (Max): 0.016" (0.40mm); Package / Case: 0402 (1005 Metric); Supplier Device Package: 0402; Size / Dimension: 0.039" L x 0.020" W (1.00mm x 0.50mm); Category: Resistors; Composition: Thick Film; Features: Moisture Resistant; Supplier Part Number 1: 311-187KLRCT-ND; RoHS: RoHS Compliant; Part Status: Active; Supplier 1: Digi-Key; Packaging: Cut Tape (CT); Operating Temperature: -55°C ~ 155°C; Failure Rate: -
R80 = Res_0402: Manufacturer: Yageo; Manufacturer Part Number 1: RC0402FR-0727KL; Part Description: 27 kOhms ±1% 0.063W, 1/16W Chip Resistor 0402 (1005 Metric) Moisture Resistant Thick Film; Resistance: 27kR; Power Rating: 63mW; Temperature Coefficient: 100ppm/°C; Voltage Rating: 50V; ComponentLink1URL: http://www.yageo.com/documents/recent/PYu-RC_Group_51_RoHS_L_7.pdf; ComponentLink1Description: http://www.yageo.com/documents/recent/PYu-RC_Group_51_RoHS_L_7.pdf; Supplier 1: Digi-Key; Supplier Part Number 1: 311-27.0KLRCT-ND; Stock 1: 1102573; Pricing 1: 1=0,10000, 10=0,01600, 100=0,00660, 1000=0,00299, 2500=0,00259, 5000=0,00214 (USD); RoHS: Yes; Case/Package: 0402; Case Code (Imperial): 0402; Case Code (Metric): 1005; Size Code: 0402; Min Operating Temperature: -55°C; Max Operating Temperature: 155°C; Tolerance: 1%; Packaging: Tape and Reel; Package Quantity: 10000; Termination: SMD/SMT; Resistor Type: Thick Film; Number of Terminations: 2; Max Power Dissipation: 63mW; Features: Moisture Resistant; Series: RC; Resistance Tolerance: 1%; Construction: Rectangular; Technology: THICK FILM; Length: 1mm; Width: 0.02inch; Height: 0.016inch; Depth: 0.5mm; REACH SVHC: Unknown; Lead Free: Lead Free; Military Standard: Not; RoHS Compliant: Yes; Value: 27k, 1%
R82 = Res_0402: Manufacturer: Yageo; Manufacturer Part Number 1: RC0402FR-0782K5L; Part Description: 82.5 kOhms ±1% 0.063W, 1/16W Chip Resistor 0402 (1005 Metric) Moisture Resistant Thick Film; Power (Watts): 0.063W, 1/16W; Temperature Coefficient: ±100ppm/°C; Value: 82.5k, 1%; RoHS: RoHS Compliant; Operating Temperature: -55°C ~ 155°C; Packaging: Cut Tape (CT); Category: Resistors; Failure Rate: -; Supplier Part Number 1: 311-82.5KLRCT-ND; Part Status: Active; Tolerance: ±1%; Features: Moisture Resistant; Supplier Device Package: 0402; Height - Seated (Max): 0.016" (0.40mm); Supplier 1: Digi-Key; Composition: Thick Film; Size / Dimension: 0.039" L x 0.020" W (1.00mm x 0.50mm); Package / Case: 0402 (1005 Metric)
R84 R86 R91 R94 R96 R98 = Res_0402: Manufacturer Part Number 1: RMCF0402FT100R; Manufacturer: Stackpole Electronics Inc.; Part Description: RES SMD 100 OHM 1% 1/16W 0402; Power (Watts): 0.063W, 1/16W; Temperature Coefficient: ±100ppm/°C; Resistance (Ohms): 100; Value: 100R, 1%; Supplier 1: Digi-Key; Supplier Part Number 1: RMCF0402FT100RDKR-ND; Packaging: Digi-Reel®; Composition: Thick Film; Number of Terminations: 2; Package / Case: 0402 (1005 Metric); RoHS: RoHS Compliant; Category: Resistors; Size / Dimension: 0.039" L x 0.020" W (1.00mm x 0.50mm); Tolerance: ±1%; Supplier Device Package: 0402; Features: -; Height: 0.016" (0.40mm); Operating Temperature: -55°C ~ 155°C
R87 = Res_0402: Manufacturer: Yageo; Manufacturer Part Number 1: RC0402FR-07118KL; Part Description: 118 kOhms ±1% 0.063W, 1/16W Chip Resistor 0402 (1005 Metric) Moisture Resistant Thick Film; Temperature Coefficient: ±100ppm/°C; Power (Watts): 0.063W, 1/16W; Value: 118k, 1%; Package / Case: 0402 (1005 Metric); Packaging: Cut Tape (CT); Supplier Device Package: 0402; Features: Moisture Resistant; Part Status: Active; Failure Rate: -; Composition: Thick Film; Operating Temperature: -55°C ~ 155°C; Category: Resistors; Tolerance: ±1%; Supplier Part Number 1: YAG2369CT-ND; Supplier 1: Digi-Key; Size / Dimension: 0.039" L x 0.020" W (1.00mm x 0.50mm); RoHS: RoHS Compliant; Height - Seated (Max): 0.016" (0.40mm)
R88 R92 = Res_0402: as R47 on sheet 08_FPGA; Supplier 1: Digi-Key; Supplier Part Number 1: 311-4.7KLRCT-ND; RoHS: RoHS Compliant; Category: Resistors; Stock 1: 4788231; Pricing 1: 1=0.1, 10=0.014, 100=0.0056, 1000=0.00253, 2500=0.0022, 5000=0.00181 (USD); Packaging: Cut Tape (CT); Part Status: Active; Tolerance: ±1%; Composition: Thick Film; Features: Moisture Resistant; Operating Temperature: -55°C ~ 155°C; Package / Case: 0402 (1005 Metric); Supplier Device Package: 0402; Size / Dimension: 0.039" L x 0.020" W (1.00mm x 0.50mm); Height - Seated (Max): 0.016" (0.40mm); Failure Rate: -; ComponentLink1URL: http://www.yageo.com/documents/recent/PYu-RC_Group_51_RoHS_L_7.pdf; ComponentLink1Description: http://www.yageo.com/documents/recent/PYu-RC_Group_51_RoHS_L_7.pdf; Value: 4K7, 1%
R90 = Res_0402: Manufacturer Part Number 1: RC0402JR-07150KL; Manufacturer: Yageo; Part Description: 150 kOhms ±5% 0.063W, 1/16W Chip Resistor 0402 (1005 Metric) Moisture Resistant Thick Film; Power (Watts): 0.063W, 1/16W; Tolerance: ±5%; Temperature Coefficient: ±100ppm/°C; Value: 150k, 1%; Operating Temperature: -55°C ~ 155°C; Composition: Thick Film; Category: Resistors; Height - Seated (Max): 0.016" (0.40mm); Failure Rate: -; Features: Moisture Resistant; Part Status: Active; Package / Case: 0402 (1005 Metric); Size / Dimension: 0.039" L x 0.020" W (1.00mm x 0.50mm); Packaging: Cut Tape (CT); Supplier 1: Digi-Key; Supplier Device Package: 0402; Supplier Part Number 1: 311-150KJRCT-ND; RoHS: RoHS Compliant
VT4 = NDS331N: Manufacturer: Infineon Technologies; Part Description: N-Channel 20V 6.3A (Ta) 1.3W (Ta) Surface Mount Micro3™/SOT-23; FET Type: N-Channel; Current - Continuous Drain (Id) @ 25°C: 6.3A (Ta); Drive Voltage (Max Rds On,  Min Rds On): 2.5V, 4.5V; Vgs(th) (Max) @ Id: 1.1V @ 10µA; Gate Charge (Qg) (Max) @ Vgs: 8.9nC @ 4.5V; Input Capacitance (Ciss) (Max) @ Vds: 700pF @ 16V; Vgs (Max): ±12V; Power Dissipation (Max): 1.3W (Ta); Rds On (Max) @ Id, Vgs: 21 mOhm @ 6.3A, 4.5V; Supplier 1: Digi-Key; Supplier Part Number 1: IRLML6244TRPBFTR-ND; Manufacturer Part Number 1: IRLML6244TRPBF; RoHS: RoHS Compliant; Category: Discrete Semiconductor Products; Stock 1: 21000; Pricing 1: 3000=0.09979 (USD); Packaging: Tape & Reel (TR); Part Status: Active; Technology: MOSFET (Metal Oxide); FET Feature: -; Operating Temperature: -55°C ~ 150°C (TJ); Mounting Type: Surface Mount; Supplier Device Package: Micro3™/SOT-23; Package / Case: TO-236-3, SC-59, SOT-23-3; ComponentLink1URL: https://www.infineon.com/dgdl/irlml6244pbf.pdf?fileId=5546d462533600a4015356686fed261f; ComponentLink1Description: https://www.infineon.com/dgdl/irlml6244pbf.pdf?fileId=5546d462533600a4015356686fed261f
XO1 = Rakon_RTX5032A: Part Description: E7355LF 40MHz, High performance TCXO, With VC, 6-pin 5mm x 3.2 mm x 2.1 mm package; Manufacturer: Rakon; Manufacturer Part Number 1: E7355LF; Supplier Part Number 1: E7355LF; Supplier 1: RAKON

## Nets that join several sheets
GND: 05_LMS7002M_Misc (15 pins), 06_LMS7002M_RF (47 pins), 07_LMS7002M_Power (98 pins), 08_FPGA (164 pins), 09_USB3_0_FIFO (42 pins), 10_Misc (89 pins)
VCC1P1: 08_FPGA (24 pins), 10_Misc (C180.2 IC13.4 R74.2)
VCC1P8: 07_LMS7002M_Power (FR23.1), 10_Misc (9 pins)
VCC1P8_LMS: 06_LMS7002M_RF (13 pins), 07_LMS7002M_Power (15 pins)
VCC2P5: 08_FPGA (9 pins), 10_Misc (5 pins)
VCC3P3: 06_LMS7002M_RF (R14.1 R20.1), 08_FPGA (25 pins), 09_USB3_0_FIFO (20 pins), 10_Misc (26 pins)
VCC5P0: 06_LMS7002M_RF (R15.1 R21.1), 08_FPGA (J4.5 J5.7 R43.1), 09_USB3_0_FIFO (FR36.2), 10_Misc (7 pins)
VDIO_LMS: 05_LMS7002M_Misc (9 pins), 07_LMS7002M_Power (5 pins), 10_Misc (C198.2 FR45.2)
VDIO_LMS_FPGA: 08_FPGA (9 pins), 10_Misc (C197.2 FR45.1 R97.2 R100.2)
FAN_CTRL: 08_FPGA (IC7.A11), 10_Misc (VT4.G)
FPGA_CFG_SPI_MISO: 08_FPGA (IC7.T18), 10_Misc (IC15.2)
FPGA_CFG_SPI_MOSI: 08_FPGA (IC7.U18), 10_Misc (IC15.5)
FPGA_CFG_SPI_SCLK: 08_FPGA (IC7.U16), 10_Misc (IC15.6 R75.1)
FPGA_CFG_SPI_SS: 08_FPGA (IC7.U17), 10_Misc (IC15.1 R77.1)
FPGA_GPIO4: 08_FPGA (IC7.M18 J3.5), 10_Misc (JMP1.2)
FPGA_GPIO5: 08_FPGA (IC7.R18 J3.6), 10_Misc (JMP2.2)
FPGA_GPIO6: 08_FPGA (IC7.T17 J3.7), 10_Misc (JMP3.2)
FPGA_GPIO7: 08_FPGA (IC7.R17 J3.8), 10_Misc (JMP4.2)
FPGA_I2C_SCL: 08_FPGA (IC7.C10), 10_Misc (IC10.2 IC12.6 R70.2)
FPGA_I2C_SDA: 08_FPGA (IC7.B9), 10_Misc (IC10.1 IC12.5 R68.2)
FPGA_LED1_G: 08_FPGA (IC7.R16), 10_Misc (R84.2)
FPGA_LED1_R: 08_FPGA (IC7.V17), 10_Misc (R86.2)
FPGA_SPI_DAC_SS: 08_FPGA (IC7.L4), 10_Misc (IC11.1 IC16.5)
FPGA_SPI_LMS_SS: 05_LMS7002M_Misc (R9.2), 08_FPGA (IC7.N3)
FPGA_SPI_MISO: 05_LMS7002M_Misc (R8.2), 08_FPGA (IC7.K3)
FPGA_SPI_MOSI: 05_LMS7002M_Misc (R7.2), 08_FPGA (IC7.L3), 10_Misc (IC11.3 IC16.7)
FPGA_SPI_SCLK: 05_LMS7002M_Misc (R6.2), 08_FPGA (IC7.M3), 10_Misc (IC11.2 IC16.6)
FT_BE0: 08_FPGA (IC7.L15), 09_USB3_0_FIFO (IC8.4)
FT_BE1: 08_FPGA (IC7.J17), 09_USB3_0_FIFO (IC8.5)
FT_BE2: 08_FPGA (IC7.K16), 09_USB3_0_FIFO (IC8.6)
FT_BE3: 08_FPGA (IC7.H17), 09_USB3_0_FIFO (IC8.7)
FT_CLK: 08_FPGA (IC7.D17), 09_USB3_0_FIFO (R59.1)
FT_D0: 08_FPGA (IC7.A13), 09_USB3_0_FIFO (IC8.40)
FT_D1: 08_FPGA (IC7.B12), 09_USB3_0_FIFO (IC8.41)
FT_D2: 08_FPGA (IC7.B15), 09_USB3_0_FIFO (IC8.42)
FT_D3: 08_FPGA (IC7.C12), 09_USB3_0_FIFO (IC8.43)
FT_D4: 08_FPGA (IC7.A16), 09_USB3_0_FIFO (IC8.44)
FT_D5: 08_FPGA (IC7.A12), 09_USB3_0_FIFO (IC8.45)
FT_D6: 08_FPGA (IC7.D18), 09_USB3_0_FIFO (IC8.46)
FT_D7: 08_FPGA (IC7.B17), 09_USB3_0_FIFO (IC8.47)
FT_D8: 08_FPGA (IC7.F15), 09_USB3_0_FIFO (IC8.50)
FT_D9: 08_FPGA (IC7.D16), 09_USB3_0_FIFO (IC8.51)
FT_D10: 08_FPGA (IC7.D15), 09_USB3_0_FIFO (IC8.52)
FT_D11: 08_FPGA (IC7.C13), 09_USB3_0_FIFO (IC8.53)
FT_D12: 08_FPGA (IC7.H18), 09_USB3_0_FIFO (IC8.54)
FT_D13: 08_FPGA (IC7.B13), 09_USB3_0_FIFO (IC8.55)
FT_D14: 08_FPGA (IC7.J18), 09_USB3_0_FIFO (IC8.56)
FT_D15: 08_FPGA (IC7.A15), 09_USB3_0_FIFO (IC8.57)
FT_D16: 08_FPGA (IC7.B18), 09_USB3_0_FIFO (IC8.60)
FT_D17: 08_FPGA (IC7.C18), 09_USB3_0_FIFO (IC8.61)
FT_D18: 08_FPGA (IC7.A17), 09_USB3_0_FIFO (IC8.62)
FT_D19: 08_FPGA (IC7.K18), 09_USB3_0_FIFO (IC8.63)
FT_D20: 08_FPGA (IC7.C15), 09_USB3_0_FIFO (IC8.64)
FT_D21: 08_FPGA (IC7.L18), 09_USB3_0_FIFO (IC8.65)
FT_D22: 08_FPGA (IC7.F18), 09_USB3_0_FIFO (IC8.66)
FT_D23: 08_FPGA (IC7.C16), 09_USB3_0_FIFO (IC8.67)
FT_D24: 08_FPGA (IC7.G16), 09_USB3_0_FIFO (IC8.69)
FT_D25: 08_FPGA (IC7.D13), 09_USB3_0_FIFO (IC8.70)
FT_D26: 08_FPGA (IC7.G18), 09_USB3_0_FIFO (IC8.71)
FT_D27: 08_FPGA (IC7.F16), 09_USB3_0_FIFO (IC8.72)
FT_D28: 08_FPGA (IC7.C17), 09_USB3_0_FIFO (IC8.73)
FT_D29: 08_FPGA (IC7.F17), 09_USB3_0_FIFO (IC8.74)
FT_D30: 08_FPGA (IC7.K15), 09_USB3_0_FIFO (IC8.75)
FT_D31: 08_FPGA (IC7.K17), 09_USB3_0_FIFO (IC8.76)
FT_OEn: 08_FPGA (IC7.L16), 09_USB3_0_FIFO (IC8.13)
FT_RDn: 08_FPGA (IC7.H15), 09_USB3_0_FIFO (IC8.12)
FT_RESETn: 08_FPGA (IC7.M17), 09_USB3_0_FIFO (C132.1 IC8.15 R56.1)
FT_RXFn: 08_FPGA (IC7.H16), 09_USB3_0_FIFO (IC8.9)
FT_TXEn: 08_FPGA (IC7.M16), 09_USB3_0_FIFO (IC8.8)
FT_WAKEUPn: 08_FPGA (IC7.G15), 09_USB3_0_FIFO (IC8.16 R55.1)
FT_WRn: 08_FPGA (IC7.J16), 09_USB3_0_FIFO (IC8.11)
LM75_OS: 08_FPGA (IC7.K2), 10_Misc (IC10.3 R62.1)
LMK_CLK: 08_FPGA (IC7.A9), 10_Misc (IC9.13)
LMS_CORE_LDO_EN: 05_LMS7002M_Misc (IC1.U33 R5.1), 08_FPGA (IC7.C6)
LMS_DIQ1_D0: 05_LMS7002M_Misc (IC1.AG31), 08_FPGA (IC7.J2)
LMS_DIQ1_D1: 05_LMS7002M_Misc (IC1.AF30), 08_FPGA (IC7.L1)
LMS_DIQ1_D2: 05_LMS7002M_Misc (IC1.AF34), 08_FPGA (IC7.K1)
LMS_DIQ1_D3: 05_LMS7002M_Misc (IC1.AE31), 08_FPGA (IC7.K4)
LMS_DIQ1_D4: 05_LMS7002M_Misc (IC1.AD30), 08_FPGA (IC7.G3)
LMS_DIQ1_D5: 05_LMS7002M_Misc (IC1.AC29), 08_FPGA (IC7.F4)
LMS_DIQ1_D6: 05_LMS7002M_Misc (IC1.AE33), 08_FPGA (IC7.J1)
LMS_DIQ1_D7: 05_LMS7002M_Misc (IC1.AD32), 08_FPGA (IC7.H1)
LMS_DIQ1_D8: 05_LMS7002M_Misc (IC1.AC31), 08_FPGA (IC7.G4)
LMS_DIQ1_D9: 05_LMS7002M_Misc (IC1.AC33), 08_FPGA (IC7.F2)
LMS_DIQ1_D10: 05_LMS7002M_Misc (IC1.AB30), 08_FPGA (IC7.G1)
LMS_DIQ1_D11: 05_LMS7002M_Misc (IC1.AB32), 08_FPGA (IC7.H2)
LMS_DIQ2_D0: 05_LMS7002M_Misc (IC1.H30), 08_FPGA (IC7.A3)
LMS_DIQ2_D1: 05_LMS7002M_Misc (IC1.J31), 08_FPGA (IC7.C2)
LMS_DIQ2_D2: 05_LMS7002M_Misc (IC1.K30), 08_FPGA (IC7.A2)
LMS_DIQ2_D3: 05_LMS7002M_Misc (IC1.K32), 08_FPGA (IC7.B4)
LMS_DIQ2_D4: 05_LMS7002M_Misc (IC1.L31), 08_FPGA (IC7.C3)
LMS_DIQ2_D5: 05_LMS7002M_Misc (IC1.K34), 08_FPGA (IC7.B2)
LMS_DIQ2_D6: 05_LMS7002M_Misc (IC1.M30), 08_FPGA (IC7.D3)
LMS_DIQ2_D7: 05_LMS7002M_Misc (IC1.M32), 08_FPGA (IC7.B1)
LMS_DIQ2_D8: 05_LMS7002M_Misc (IC1.N31), 08_FPGA (IC7.A4)
LMS_DIQ2_D9: 05_LMS7002M_Misc (IC1.N33), 08_FPGA (IC7.C1)
LMS_DIQ2_D10: 05_LMS7002M_Misc (IC1.P30), 08_FPGA (IC7.C7)
LMS_DIQ2_D11: 05_LMS7002M_Misc (IC1.P32), 08_FPGA (IC7.A6)
LMS_EN_IQSEL1: 05_LMS7002M_Misc (IC1.Y32), 08_FPGA (IC7.F3)
LMS_EN_IQSEL2: 05_LMS7002M_Misc (IC1.R33), 08_FPGA (IC7.C4)
LMS_FCLK1: 05_LMS7002M_Misc (IC1.AA33), 08_FPGA (IC7.H3)
LMS_FCLK2: 05_LMS7002M_Misc (IC1.R29), 08_FPGA (IC7.D1)
LMS_MCLK1: 05_LMS7002M_Misc (IC1.AB34), 08_FPGA (IC7.H4)
LMS_MCLK2: 05_LMS7002M_Misc (IC1.P34), 08_FPGA (IC7.D2)
LMS_RESET: 05_LMS7002M_Misc (IC1.E27 R2.1), 08_FPGA (IC7.A7)
LMS_RXEN: 05_LMS7002M_Misc (IC1.V34 R4.2), 08_FPGA (IC7.D6)
LMS_TXEN: 05_LMS7002M_Misc (IC1.U29 R3.2), 08_FPGA (IC7.B7)
LMS_TXNRX1: 05_LMS7002M_Misc (IC1.V32 R1.1), 08_FPGA (IC7.F1)
LMS_TXNRX2: 05_LMS7002M_Misc (IC1.U31 R10.1), 08_FPGA (IC7.B6)
RFSW_RX_V1: 06_LMS7002M_RF (C29.2 IC4.5), 08_FPGA (IC7.C11)
RFSW_RX_V2: 06_LMS7002M_RF (C28.2 IC4.2), 08_FPGA (IC7.B11)
RFSW_TX_V1: 06_LMS7002M_RF (C14.2 IC3.5), 08_FPGA (IC7.B10)
RFSW_TX_V2: 06_LMS7002M_RF (C13.2 IC3.2), 08_FPGA (IC7.C9)
RxPLL_CLK: 05_LMS7002M_Misc (IC1.AM24), 10_Misc (C160.2 R69.1)
TX_LB_AT: 06_LMS7002M_RF (C19.1 R17.2), 08_FPGA (IC7.C8)
TX_LB_SH: 06_LMS7002M_RF (C20.1 C23.1 R24.1 R25.2), 08_FPGA (IC7.B8)
TxPLL_CLK: 05_LMS7002M_Misc (IC1.E5), 10_Misc (C158.2 R65.1)